# Altium project HA.PrjPcb
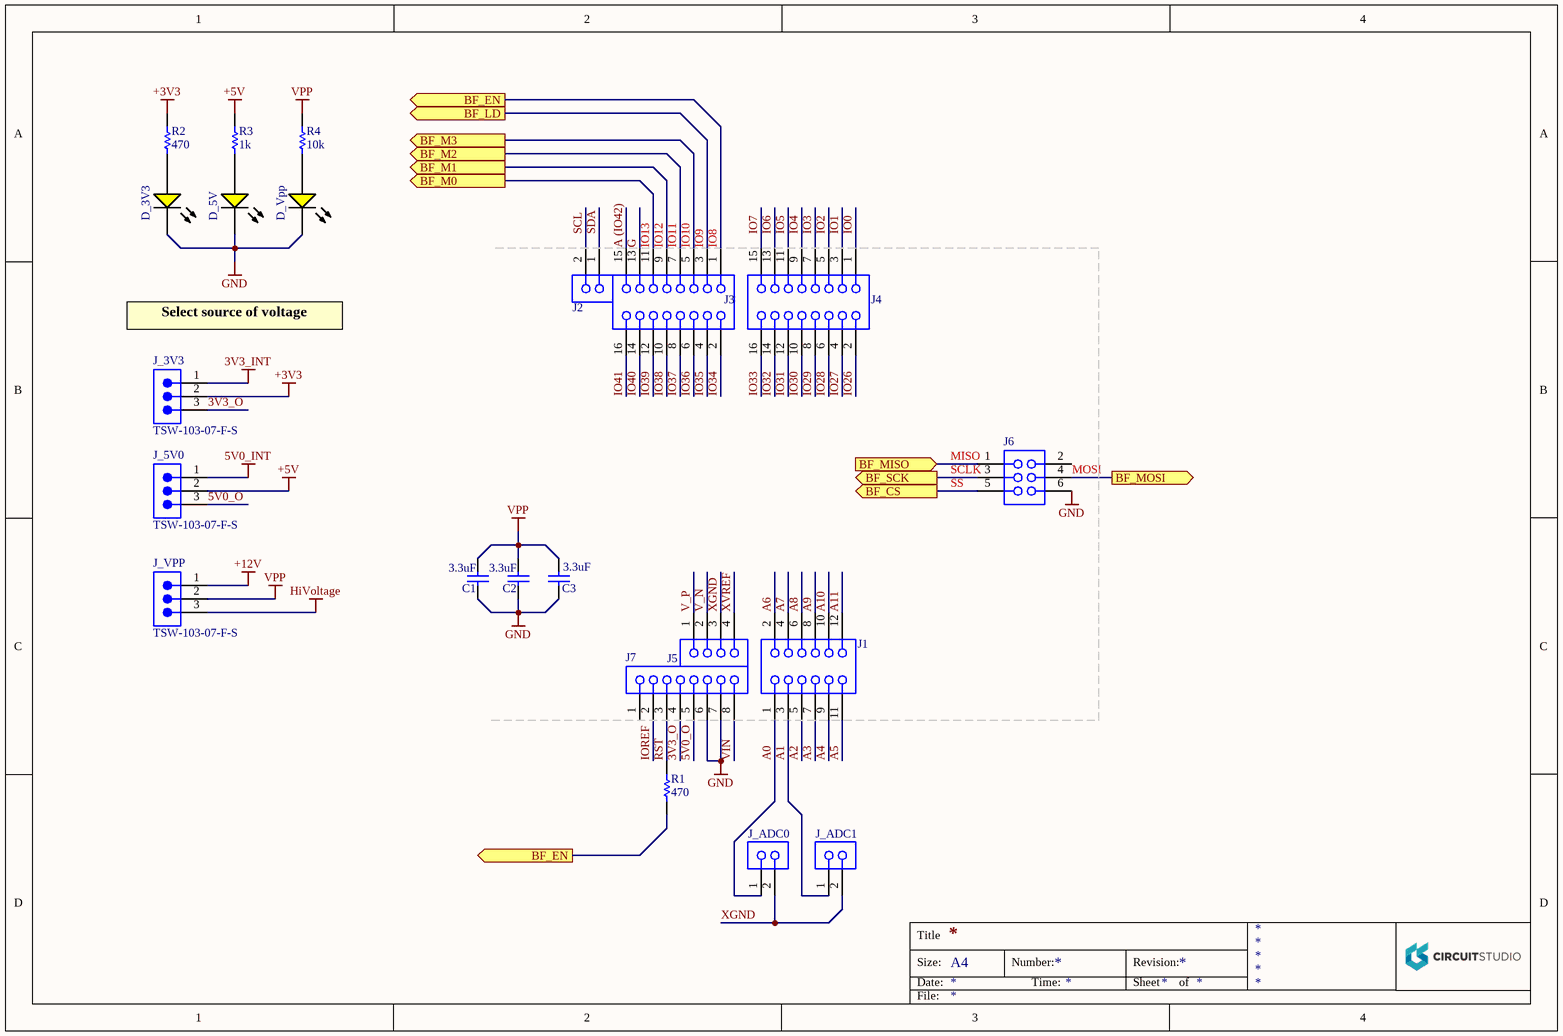
[diagram p0: HA_Diagram.SchDoc]
4 sheets, 87 parts. Net scope: flat (ports and power ports of the same name join across sheets).
Sheets:
  HA_Diagram.SchDoc
  HA_Power.SchDoc
  HA_HiPower.SchDoc
  HA_Out.SchDoc

## Sheet HA_Diagram.SchDoc
size A4; PageSetup: Record=PageOptions|CenterHorizontal=True|CenterVertical=True|PrintScale=1.00|XCorrection=1.00|YCorrection=1.00|PrintKind=0|BorderSize=5000000|LeftOffset=0|BottomOffset=0|Orientation=2|PaperLength=1000|PaperWidth=1000|Scale=100|PaperSource=7|PrintQuality=-3|MediaType=1|DitherType=10|PrintScaleMode=1|PaperKind=A4|PaperIndex=9

### Parts
C1  value 3.3uF  [CAPC1206(3216)190_N]  (hidden comment: 3.3uF 100V)
C2  value 3.3uF  [CAPC1206(3216)190_N]  (hidden comment: 3.3uF 100V)
C3  value 3.3uF  [CAPC1206(3216)190_N]  (hidden comment: 3.3uF 100V)
D_3V3  LED 0603  [LTST-C190KSKT_V]  (value not drawn)
D_5V  LED 0603  [LTST-C190KSKT_V]  (value not drawn)
D_Vpp  LED 0603  [LTST-C190KSKT_V]  (value not drawn)
J1  SSW-106-01-F-D  [SMTC-SSW-106-01-X-D]  (value not drawn)
J2  PHF-102-03-L-S  [SMTC-PHF-102-03-X-S]  (value not drawn)
J3  ESW-108-12-G-D  [SMTC-ESW-108-12-X-D]  (value not drawn)
J4  ESW-108-12-G-D  [SMTC-ESW-108-12-X-D]  (value not drawn)
J5  SLW-104-01-F-S  [SMTC-SLW-104-01-X-S]  (value not drawn)
J6  SSW-103-01-F-D  [SMTC-SSW-103-01-X-D]  (value not drawn)
J7  SSQ-108-01-F-S  [SMTC-SSQ-108-01-X-S]  (value not drawn)
J_3V3  TSW-103-07-F-S  [SMTC-TSW-103-07-X-S]
J_5V0  TSW-103-07-F-S  [SMTC-TSW-103-07-X-S]
J_ADC0  PHF-102-03-L-S  [SMTC-PHF-102-03-X-S]  (value not drawn)
J_ADC1  PHF-102-03-L-S  [SMTC-PHF-102-03-X-S]  (value not drawn)
J_VPP  TSW-103-07-F-S  [SMTC-TSW-103-07-X-S]
R1  470  [RESC0603(1608)_N]
R2  470  [RESC0603(1608)_N]
R3  1k  [RESC0603(1608)_N]
R4  10k  [RESC0603(1608)_N]

### Ports
BF_CS (out), BF_EN (out), BF_LD (out), BF_M0 (out), BF_M1 (out), BF_M2 (out), BF_M3 (out), BF_MISO (in), BF_MOSI (out), BF_SCK (out)

### Nets
3V3_INT: J_3V3.1
5V0_INT: J_5V0.1
+3V3: J_3V3.2 R2.1
+5V: J_5V0.2 R3.1
+12V: J_VPP.1
GND: C1.1 C2.1 C3.1 D_3V3.2(K) D_5V.2(K) D_Vpp.2(K) J6.6 J7.6 J7.7
HiVoltage: J_VPP.3
VPP: C1.2 C2.2 C3.2 J_VPP.2 R4.1
3V3_O: J7.4 J_3V3.3
5V0_O: J7.5 J_5V0.3
A0: J1.1 J_ADC0.1
A1: J1.3 J_ADC1.1
A2: J1.5
A3: J1.7
A4: J1.9
A5: J1.11
A6: J1.2
A7: J1.4
A8: J1.6
A9: J1.8
A10: J1.10
A11: J1.12
A (IO42): J3.15
BF_CS: J6.5 ; port BF_CS
BF_EN: J3.1 R1.2 ; port BF_EN
BF_LD: J3.3 ; port BF_LD
BF_M0: J3.11 ; port BF_M0
BF_M1: J3.9 ; port BF_M1
BF_M2: J3.7 ; port BF_M2
BF_M3: J3.5 ; port BF_M3
BF_MISO: J6.1 ; port BF_MISO
BF_MOSI: J6.4 ; port BF_MOSI
BF_SCK: J6.3 ; port BF_SCK
G: J3.13
IO0: J4.1
IO1: J4.3
IO2: J4.5
IO3: J4.7
IO4: J4.9
IO5: J4.11
IO6: J4.13
IO7: J4.15
IO26: J4.2
IO27: J4.4
IO28: J4.6
IO29: J4.8
IO30: J4.10
IO31: J4.12
IO32: J4.14
IO33: J4.16
IO34: J3.2
IO35: J3.4
IO36: J3.6
IO37: J3.8
IO38: J3.10
IO39: J3.12
IO40: J3.14
IO41: J3.16
IOREF: J7.2
RST: J7.3 R1.1
SCL: J2.2
SDA: J2.1
V_N: J5.2
V_P: J5.1
VIN: J7.8
XGND: J5.3 J_ADC0.2 J_ADC1.2
XVREF: J5.4
NetD_3V3_1: D_3V3.1(A) R2.2
NetD_5V_1: D_5V.1(A) R3.2
NetD_Vpp_1: D_Vpp.1(A) R4.2

Not connected (* = marked no-connect by the designer): J6 2; J7 1

### Notes on the sheet
- (near J3) IO13
- (near J3) IO12
- (near J3) IO11
- (near J3) IO10
- (near J3) IO9
- (near J3) IO8
- Select source of voltage
- (near J6) MISO
- (near J6) SCLK
- (near J6) SS
- (near J6) MOSI
- Title
- Size:
- Date:
- A4
- Number:
- Time:
- Revision:
- Sheet
- of
- File:

### Library data of the parts
C1-C3 = CMP-1037-04411-1: CAP 3.3uF 100V ±20% 1206 (3216 Metric) Thickness 1.9mm SMD; Case-Metric: 3216; Tolerance: Â±20%; Case-EIA: 1206; Max Thickness: 1.9 mm; Rated Voltage: 100 V; Technology: SMT
D_3V3 D_5V D_Vpp = CMP-1674-00009-1: Voltage Rating: 50 V; Case\Package: 0603; Power Rating: 100 mW; Tolerance: 1%; Resistance: 12 kohm; Packaging: Tape and Reel; RoHSCompliant: true; Height: 0.45 mm; Max Operating Temperature: 155 degC; Mount: Surface Mount; DatasheetVersion: Rev. I, 10/2012; Min Operating Temperature: -55 degC; PackageReference: C190KSKT; ComponentLink1Description: Manufacturer URL; Length: 1.6 mm; REACH SVHC: No SVHC; Case Code (Imperial): 0603; Voltage Rating (DC): 50 V; PackageDescription: 2-Pin Surface Mount Device, Body 1.6 x 0.8 mm; Case Code (Metric): 1608; Package Quantity: 5000; ComponentLink2Description: Datasheet; Width: 0.8 mm; Pins: 2; ComponentLink2URL: http://optoelectronics.liteon.com/upload/download/DS-22-99-0189/S_110_LTST-C190KSKT.pdf; ComponentLink1URL: http://www.us.liteon.com/
J1 = CMP-1023-00357-1: SQ Post Socket, Through-hole, Vertical, -55 to 125 degC, 2.54mm Pitch, 12-Pin, Female, RoHS; Manufacturer: Samtec; Temperature Range: -55 to 125 degC; ComponentLink3Description: Package Specification; RoHS: True; PackageDescription: Assembly, Socket Strip .016 X .031 Tail; ComponentLink2URL: http://www.samtec.com/documents/webfiles/pdf/SSW_TH.PDF; ComponentLink1Description: Manufacturer URL; DatasheetVersion: F-214; Orientation: Vertical; PackageReference: SSW-106-01-X-D; Pitch: 2.54 mm; ComponentLink3URL: http://www.samtec.com/documents/webfiles/cpdf/SSW-1XX-XX-XXX-X-XX-XXX-XX-MKT.pdf; PartNumber: SSW-106-01-F-D; Mounting Technology: Through-hole; ComponentLink1URL: http://www.samtec.com; ComponentLink2Description: Datasheet; PackageVersion: CA, 6/1987
J2 J_ADC0 J_ADC1 = CMP-1023-00105-1: Press Fit Socket, Through-hole, Vertical, -55 to 125 degC, 2.54 mm Pitch, 2-Pin, Female, RoHS; Manufacturer: Samtec; Pitch: 2.54 mm; Orientation: Vertical; RoHS: True; DatasheetVersion: F-214; PackageReference: PHF-102-03-X-S; Temperature Range: -55 to 125 degC; ComponentLink1Description: Manufacturer URL; ComponentLink3Description: Package Specification; PackageVersion: F, 9/2009; ComponentLink2Description: Datasheet; ComponentLink3URL: http://www.samtec.com/documents/webfiles/cpdf/PHF-1XX-XX-X-X-XXX-MKT.pdf; PartNumber: PHF-102-03-L-S; ComponentLink1URL: http://www.samtec.com; ComponentLink2URL: http://www.samtec.com/documents/webfiles/pdf/phf.pdf; Mounting Technology: Through-hole; PackageDescription: .100 Press Fit Socket Assembly
J3 J4 = CMP-1023-00046-1: Elevated Socket, Through-hole, Vertical, -55 to 125 degC, 2.54 mm Pitch, 16-Pin, Female, RoHS; Manufacturer: Samtec; Pitch: 2.54 mm; PackageVersion: AV, 7/1985; PackageReference: ESW-108-12-X-D; ComponentLink2Description: Datasheet; ComponentLink1Description: Manufacturer URL; DatasheetVersion: F-214; Temperature Range: -55 to 125 degC; Mounting Technology: Through-hole; PartNumber: ESW-108-12-G-D; RoHS: True; PackageDescription: ESW Strip ASM; ComponentLink3Description: Package Specification; ComponentLink2URL: http://www.samtec.com/documents/webfiles/pdf/ESW_TH.PDF; ComponentLink3URL: http://www.samtec.com/documents/webfiles/cpdf/ESW-1XX-XX-X-X-XX-XX-MKT.pdf; Orientation: Vertical; ComponentLink1URL: http://www.samtec.com
J5 = CMP-1023-00132-1: Low Profile Socket Strips, Through-hole, Vertical, -55 to 125 degC, 2.54 mm Pitch, 4-Pin, Female, RoHS; Manufacturer: Samtec; Pitch: 2.54 mm; PackageVersion: X, 9/1987; ComponentLink2Description: Datasheet; PackageDescription: Low Profile Socket Strip; ComponentLink1URL: http://www.samtec.com; Orientation: Vertical; ComponentLink3URL: http://www.samtec.com/documents/webfiles/cpdf/SLW-1XX-01-X-X-MKT.pdf; ComponentLink1Description: Manufacturer URL; ComponentLink2URL: http://www.samtec.com/documents/webfiles/pdf/SLW.PDF; PackageReference: SLW-104-01-X-S; Mounting Technology: Through-hole; PartNumber: SLW-104-01-F-S; Temperature Range: -55 to 125 degC; DatasheetVersion: F-214; ComponentLink3Description: Package Specification; RoHS: True
J6 = CMP-1023-00329-1: SQ Post Socket, Through-hole, Vertical, -55 to 125 degC, 2.54 mm Pitch, 6-Pin, Female, RoHS; Manufacturer: Samtec; Pitch: 2.54 mm; Temperature Range: -55 to 125 degC; ComponentLink3URL: http://www.samtec.com/documents/webfiles/cpdf/SSW-1XX-XX-XXX-X-XX-XXX-XX-MKT.pdf; ComponentLink1URL: http://www.samtec.com; Orientation: Vertical; PackageReference: SSW-103-01-X-D; RoHS: True; ComponentLink1Description: Manufacturer URL; PartNumber: SSW-103-01-F-D; PackageVersion: CA, 6/1987; ComponentLink2URL: http://www.samtec.com/documents/webfiles/pdf/SSW_TH.PDF; ComponentLink3Description: Package Specification; Mounting Technology: Through-hole; PackageDescription: Assembly, Socket Strip .016 X .031 Tail; DatasheetVersion: F-214; ComponentLink2Description: Datasheet
J7 = CMP-1023-00294-1: SQ Post Socket, Through-hole, Vertical, -55 to 125 degC, 2.54 mm Pitch, 8-Pin, Female, RoHS; Manufacturer: Samtec; Pitch: 2.54 mm; ComponentLink3URL: http://www.samtec.com/documents/webfiles/cpdf/SSQ-1XX-XX-XXX-X-XX-XXX-XX-X-MKT.pdf; ComponentLink2URL: http://www.samtec.com/documents/webfiles/pdf/SSQ_TH.PDF; Mounting Technology: Through-hole; PackageReference: SSQ-108-01-X-S; Orientation: Vertical; PackageDescription: Assembly, Socket Strip .025[0.64] SQ Tail; ComponentLink2Description: Datasheet; PartNumber: SSQ-108-01-F-S; Temperature Range: -55 to 125 degC; ComponentLink1URL: http://www.samtec.com; ComponentLink3Description: Package Specification; PackageVersion: BD, 6/1987; RoHS: True; ComponentLink1Description: Manufacturer URL; DatasheetVersion: F-214
J_3V3 J_5V0 J_VPP = CMP-1024-00331-1: 0.025" SQ Post Header, Through-hole, Vertical, -55 to 125 degC, 2.54 mm Pitch, 3-Pin, Male, RoHS; Manufacturer: Samtec; Pitch: 2.54 mm; DatasheetVersion: F-214; ComponentLink1Description: Manufacturer URL; ComponentLink3URL: http://www.samtec.com/documents/webfiles/cpdf/TSW-XXX-XX-XXX-X-XX-XXX-MKT.pdf; Mounting Technology: Through-hole; PackageDescription: .025[0.64] SQ. Post Terminal Strip Assembly; Temperature Range: -55 to 125 degC; ComponentLink3Description: Package Specification; Orientation: Vertical; PartNumber: TSW-103-07-F-S; RoHS: True; PackageVersion: DM, 8/1988; ComponentLink2Description: Datasheet; ComponentLink1URL: http://www.samtec.com; ComponentLink2URL: http://www.samtec.com/documents/webfiles/pdf/TSW_TH.PDF; PackageReference: TSW-103-07-X-S
R1-R4 = CMP-1012-00122-1: 200 1% 0603 SMD; Value: 200 Ohm; Tolerance: 1 %

## Sheet HA_Power.SchDoc: transc
size A4; Date: 11/21/2016 9:12:52 PM; SheetNumber: 2; PageSetup: Record=PageOptions|CenterHorizontal=True|CenterVertical=True|PrintScale=0.98|XCorrection=1.00|YCorrection=1.00|PrintKind=0|BorderSize=5000000|LeftOffset=0|BottomOffset=0|Orientation=2|PaperLength=1000|PaperWidth=1000|Scale=100|PaperSource=7|PrintQuality=-3|MediaType=1|DitherType=10|PrintScaleMode=1|PaperKind=A4|PaperIndex=9
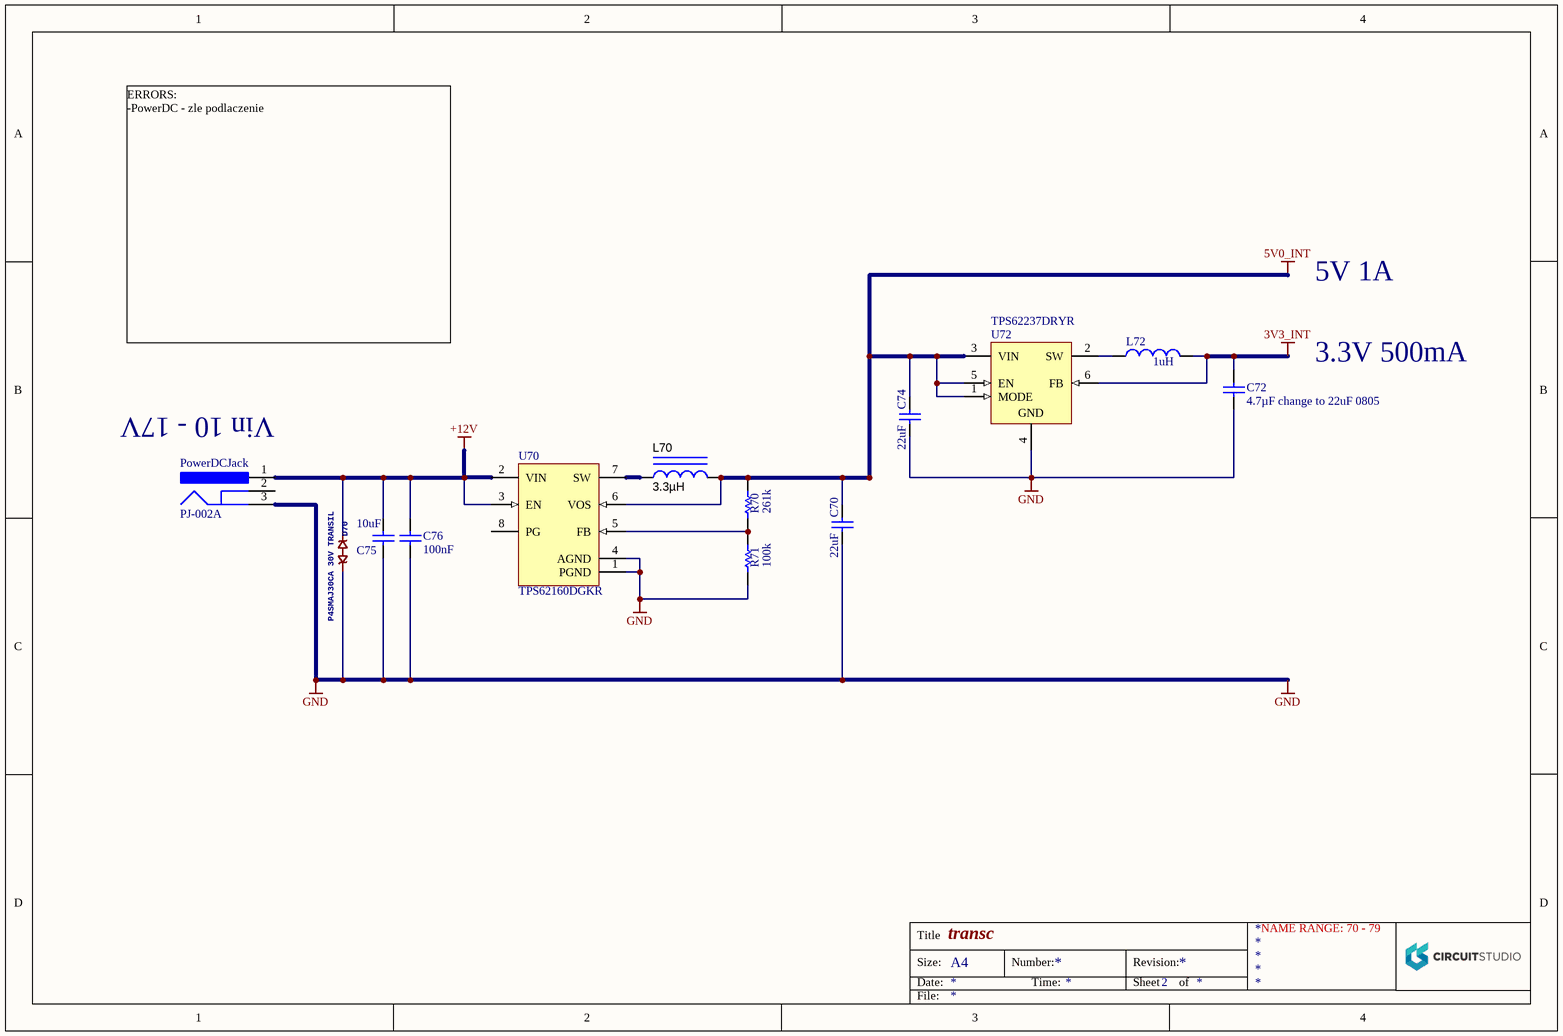
[diagram p1: HA_Power.SchDoc]

### Parts
C70  value 22uF  [CAPC0805(2012)75_N]  (hidden comment: 22uF 10V)
C72  Capacitance: 4.7µF change to 22uF 0805  [CAPC1608X95X30NL15T20]  (hidden comment: 4.7uF CL10B475KQ8NQNC)
C74  value 22uF  [CAPC0805(2012)75_N]  (hidden comment: 22uF 10V)
C75  value 10uF  [CAPC1206(3216)190_N]  (hidden comment: 10uF 35V)
C76  value 100nF  [CAPC0603(1608)100_L]  (hidden comment: 100nF 100V)
D70  P4SMAJ30CA 30V TRANSIL  [DO214AC_BIDIR]
L70  ValueDisplayed: 3.3µH  [XPL2010]  (hidden comment: 3.3uH XPL2010-332MLB)
L72  Inductance: 1uH  [MURA-IND0805_H_0.55_M]  (hidden comment: LQM21PN2R2MC0D)
PowerDCJack  PJ-002A  [CUI-PJ-002A_V]
R70  261k  [RESC0603(1608)_N]
R71  100k  [RESC0603(1608)_N]
U70  TPS62160DGKR  [DGK8_N]
U72  TPS62237DRYR  [DRY0006A]

### Nets
3V3_INT: C72.2 L72.2 U72.6(FB)
5V0_INT: C70.2 C74.2 L70.2 R70.2 U70.6(VOS) U72.1(MODE) U72.3(VIN) U72.5(EN)
+12V: C75.2 C76.1 D70.2 PowerDCJack.1 U70.2(VIN) U70.3(EN)
GND: C70.1 C72.1 C74.1 C75.1 C76.2 D70.1 PowerDCJack.3 R71.1 U70.1(PGND) U70.4(AGND) U72.4(GND)
NetL70_1: L70.1 U70.7(SW)
NetL72_1: L72.1 U72.2(SW)
NetR70_1: R70.1 R71.2 U70.5(FB)

Not connected (* = marked no-connect by the designer): PowerDCJack 2; U70 8(PG)

### Notes on the sheet
- 5V 1A
- ERRORS:
  -PowerDC - zle podlaczenie
- 3.3V 500mA
- (near PowerDCJack) Vin 10 - 17V
- NAME RANGE: 70 - 79
- Title
- Size:
- Date:
- A4
- Number:
- Time:
- Revision:
- Sheet
- of
- File:

### Library data of the parts
C70 C74 = CMP-1036-00417-1: Case-EIA: 0805; Tolerance: ±10%; Case-Metric: 2012; Technology: SMT; Max Thickness: 0.75 mm; Rated Voltage: 10 V
C72 = CMP-2000-06096-1: Manufacturer: Samsung Electro-Mechanics; Temperature Coefficient: X7R; Other Names: 1276-2087-2; Featured Product: Multi-LayerCeramicCapacitors; Voltage - Rated: 6.3V; Tolerance: ±10%; Product Training Modules: AutoGradeMLCCHighCapMLCCFamilySoftTerminationMLCC; Online Catalog: CLSeries,HighCapacitance; RoHS Information: MLCCRoHS2Compliance; Package / Case: 0603(1608Metric); Datasheet URL: http://media.digikey.com/pdf/Data%20Sheets/Samsung%20PDFs/CL10B475KQ8NQNC_Spec.pdf; Family: CeramicCapacitors; Category: Capacitors; Packaging: Tape&Reel(TR); Operating Temperature: -55°C~125°C; Datasheet Version: 09/2013; Lead Spacing: -; Mounting Type: SurfaceMount,MLCC; Ratings: -; Applications: GeneralPurpose; Height - Seated (Max): -; Series: CL; Package Reference: 0603; Manufacturer URL: http://www.samsungsem.com/global/index.jsp; Thickness (Max): 0.035"(0.90mm); Lead Style: -; Package Description: 2-Pin Surface Mount Device, Body 1.6 x 0.8 mm; Size / Dimension: 0.063"Lx0.031"W(1.60mmx0.80mm); Features: -; Mounting Technology: SurfaceMount; Standard Package: 4,000
C75 = CMP-1037-04990-1: CAP 1206 (3216 Metric) Thickness 1.9mm SMD; Rated Voltage: 10 V; Tolerance: Â±20%; Case-EIA: 1206; Case-Metric: 3216; Max Thickness: 1.9 mm; Technology: SMT
C76 = CMP-1035-00529-1: CAP 100nF 100V ±10% 0603 (1608 Metric) Thickness 1mm SMD; Case-Metric: 1608; Case-EIA: 0603; Rated Voltage: 100 V; Max Thickness: 1 mm; Technology: SMT; Tolerance: ±10%
D70 = DIODE_BIDIR-DO214AC
L70 = XPL2010-332MLB: XPL2010 Inductor; Manufacturer: Coilcraft; Ind_H: 3.3E-6; Imax_A: 1.05; Irms: 1.1A @ 40C rise; Isat: 1.05A @ 30% inductance drop; DCR_ohm: 0.21; Value1: 0.21 ohm; Value2: 1.05A; Material: Composite; SizeAreaWB_mm2: 8.7; SizeArea_mm2: 3.8; SizeX_mm: 2; SizeY_mm: 1.9; SizeZ_mm: 1; AEC Category: Q200; SymbolVersion: 2008-07-23; CompType: Inductor; Value: 3.3uH; PartNumber: XPL2010-332MLB; Technology: Shielded; MountType: SMT; PackageReference: XPL2010; Published: 2008-06-26; Publisher: Texas Instruments; LatestRevisionDate: 2016-12-22; ComponentLink1Description: Datasheet link; ComponentLink1URL: http://www.coilcraft.com/pdfs/xpl2010.pdf; RoHS: Y; AEC Qualified: ?
L72 = CMP-2000-06589-1: Chip Inductor, 1.0 uH, +/- 20%, -55 to 125 degC, 2-Pin SMD (0805), RoHS, Tape and Reel; Manufacturer: Murata; Rated Current-Max: 800mA; DC Resistance: 0.19; Mounting Technology: SurfaceMount; Package Reference: 0805; Tolerance (%): 20%; Datasheet Version: 07/2014; Manufacturer URL: http://www.murata.com/; Package Description: 2-Pin Surface Mounted Device, Body 2 x 1.25 mm; Case Size/Dimension: 0805; Datasheet URL: https://datasheet.ciiva.com/3866/336lqm21pn1r0mc023-3866307.pdf
PowerDCJack = CMP-2000-06895-1: Through Hole Right Angle DC Power Jack, 2.5 A, 2 mm Center Pin, 3 Position, -25 to 85 degC, RoHS, Bulk; Manufacturer: CUIInc.; Current Rating: 2.5A; Inside Contact Diameter: 2mm; Insulation Resistance: 50MOhms; Outside Contact Diameter: 6.5mm; Voltage Rating: 24V; Brand: CUI; Operating Temperature Range: -25Cto+85C; Mounting Technology: ThroughHole; Connector Type: DCPowerJack; Contact Material: Copper; Datasheet URL: http://www.cui.com/product/resource/pj-002a.pdf; Contact Gender: Male; Housing Material: PolybutyleneTerephthalate(PBT); Manufacturer URL: http://www.cui.com/; Package Reference: PJ-002A; Mounting Style: ThroughHole; Mounting Angle: Right; Product Category: DCPowerConnectors; Product: Jacks; Flammability Rating: UL94V-0; Contact Plating: Nickel; RoHS: True; Datasheet Version: Rev. 1.03, 04/2016; Package Description: 3-Pin Through Hole Device, Body 14.4 x 9 mm, Height 11 mm; Factory Pack Quantity: 500; Termination Style: ThroughHole
R70 R71 = CMP-1012-00122-1: 1% 0603 SMD; Value: 22k Ohm; Tolerance: 1 %
U70 = CMP-0323-00440-1: Buck Step Down Regulator with 3 to 17 V Input and 0.9 to 6 V Output, -40 to 85 degC, 8-Pin VSOP (DGK), Green (RoHS & no Sb/Br); Manufacturer: Texas Instruments; Regulated Outputs(#): 1; Vout(Min)(V): 0.9; Switch Current Limit(Typ)(A): 1.8; SubFamily: Step-Down Regulator; Vout(Max)(V): 6; Vin(Max)(V): 17; Iq(Typ)(mA): 0.017; Duty Cycle(Max)(%): 100; Synchronous Rectification: TRUE; Rating: Catalog; Vin(Min)(V): 3; PackageDescription: 8-Pin Thin Small Outline Package 3 x 3 mm Body ,0.65 mm Pitch; PackageVersion: revE, May-2006; PackageReference: DGK8; ComponentLink1URL: http://www.ti.com/general/docs/lit/getliterature.tsp?genericPartNumber=TPS62160&fileType=pdf; ComponentLink2Description: URL Link1; Iout(Max)(A): 1; ComponentLink1Description: Datasheet; Eco-Plan: Green (RoHS & no Sb/Br); Code_JEDEC: MO-187-AA; Topology: Buck; PartNumber: TPS62160DGKR; ComponentLink2URL: Samples URL:http://www.ti.com/product/tps62160#samples; DatasheetVersion: SLVSAM2A; Mounting Technology: Surface Mount
U72 = CMP-0323-00243-3: Buck Step Down Regulator with 2.05 to 6 V Input and 3.3 V Output, -40 to 85 degC, 6-Pin SON (DRY), Green (RoHS & no Sb/Br); Manufacturer: Texas Instruments; Vout(Max)(V): 3.3; Switch Current Limit(Typ)(A): 0.84; Iq(Typ)(mA): 0.022; Iout(Max)(A): 0.5; Synchronous Rectification: TRUE; Regulated Outputs(#): 1; Vin(Min)(V): 2.05; SubFamily: Step-Down Regulator; Rating: Catalog; Duty Cycle(Max)(%): 100; Vin(Max)(V): 6; PackageReference: DRY0006A; PartNumber: TPS62237DRYR; Mounting Technology: Surface Mount; Preset Vout(V): 3.3; Topology: Buck; DatasheetVersion: SLVS941E; ComponentLink2Description: Package Specification; PackageVersion: revF, Dec-2011; PackageDescription: 6-Pin Plastic Small Outline No-Lead, 1 x 1.45 x 0.6 mm Body, 0.5 mm Pitch; ComponentLink3Description: URL Link1; ComponentLink1Description: Datasheet; Eco-Plan: Green (RoHS & no Sb/Br); ComponentLink2URL: http://www.ti.com/litv/pdf/mpds221e; ComponentLink1URL: http://www.ti.com/general/docs/lit/getliterature.tsp?genericPartNumber=TPS62237&fileType=pdf; Vout(Min)(V): 3.3; ComponentLink3URL: Samples URL:http://www.ti.com/product/tps62237#samples

## Sheet HA_HiPower.SchDoc: transc
size A4; Date: 11/21/2016 9:12:53 PM; SheetNumber: 3; PageSetup: Record=PageOptions|CenterHorizontal=True|CenterVertical=True|PrintScale=1.02|XCorrection=1.00|YCorrection=1.00|PrintKind=0|BorderSize=5000000|LeftOffset=0|BottomOffset=0|Orientation=2|PaperLength=1000|PaperWidth=1000|Scale=100|PaperSource=7|PrintQuality=-3|MediaType=1|DitherType=10|PrintScaleMode=1|PaperKind=A4 (Borderless)|PaperIndex=274
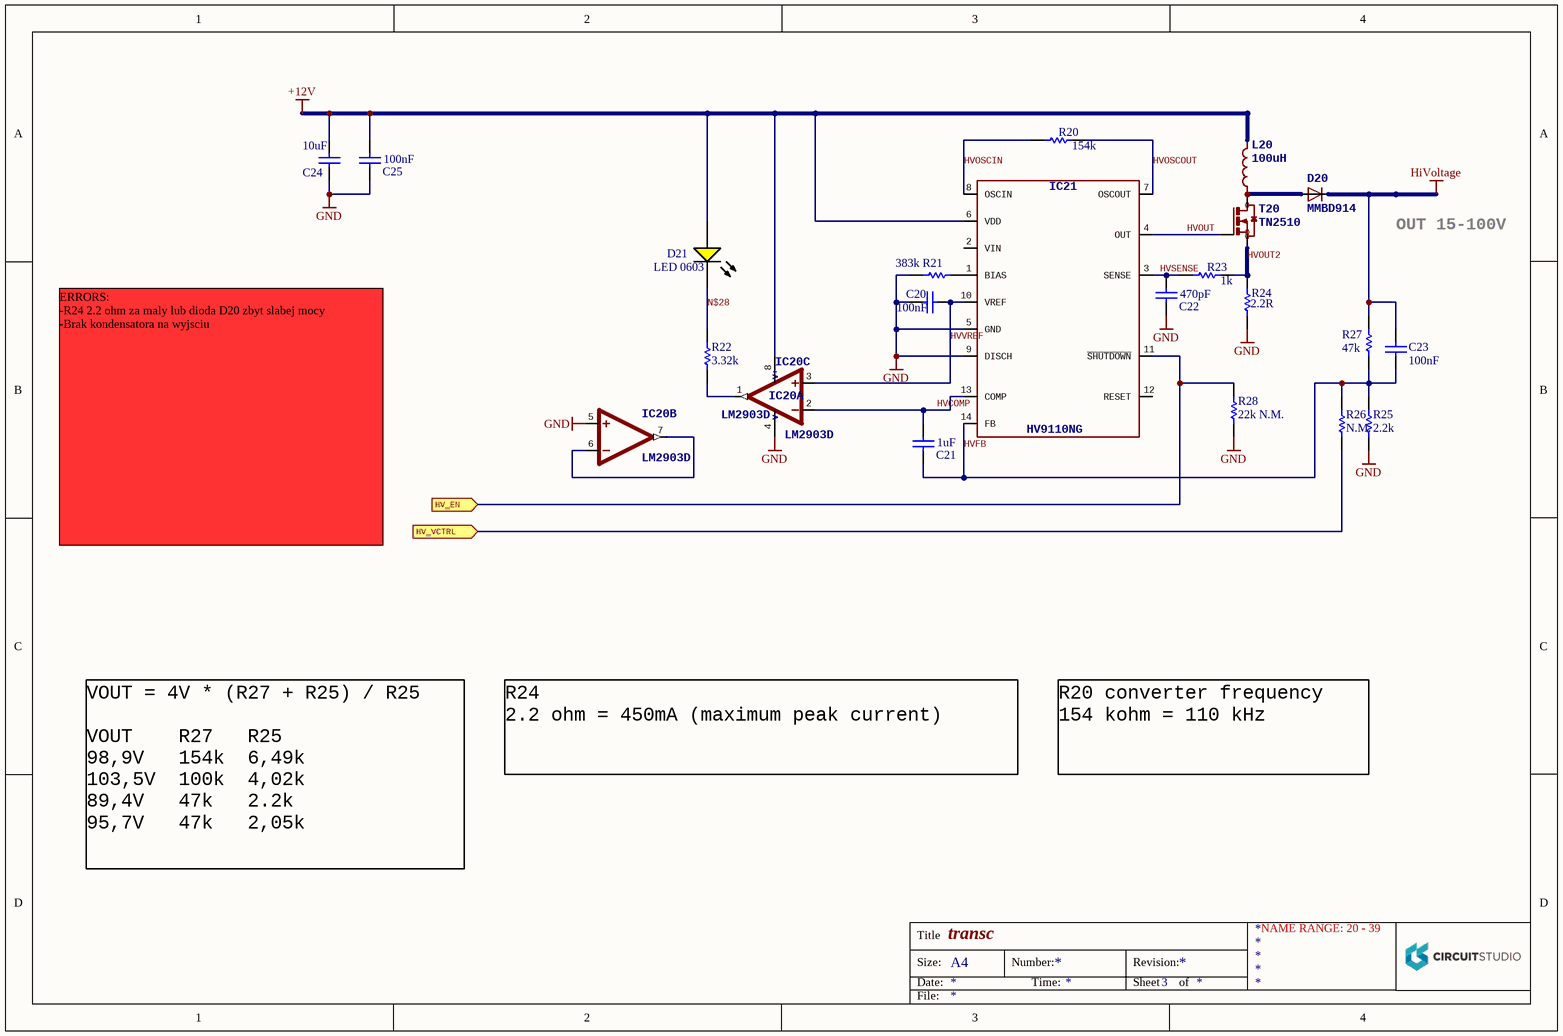
[diagram p2: HA_HiPower.SchDoc]

### Parts
C20  value 100nF  [CAPC0805(2012)145_L]  (hidden comment: 100nF 100V)
C21  value 1uF  [CAPC0805(2012)145_L]  (hidden comment: 1uF 100V)
C22  value 470pF  [CAPC0805(2012)145_L]  (hidden comment: 470pF 100V)
C23  value 100nF  [CAPC0805(2012)145_L]  (hidden comment: 100nF 100V)
C24  value 10uF  [CAPC1206(3216)190_N]  (hidden comment: 10uF 35V)
C25  value 100nF  [CAPC0805(2012)145_L]  (hidden comment: 100nF 100V)
D20  MMBD914  [SOT23]
D21  LED 0603  [LTST-C190KSKT_V]
IC20  LM2903D  [SO08]  (parts A,B,C of 3)
IC21  HV9110NG  [SOIC14]
L20  100uH  [LPS8045B]
R20  154k  [RESC0603(1608)_N]
R21  383k  [RESC0603(1608)_N]
R22  3.32k  [RESC0603(1608)_N]
R23  1k  [RESC0603(1608)_N]
R24  value 2.2R  [RESC2512(6432)_M]  (hidden comment: 2.2R 5%)
R25  2.2k  [RESC0603(1608)_N]
R26  N.M.  [RESC0603(1608)_N]
R27  47k  [RESC0603(1608)_N]
R28  22k N.M.  [RESC0603(1608)_N]
T20  TN2510  [SOT89]

### Ports
HV_EN (in), HV_VCTRL (in)

### Nets
+12V: C24.2 C25.2 D21.1(A) IC20.8(V+) IC21.6(VDD) L20.2
GND: C20.2 C22.1 C24.1 C25.1 IC20.4(V-) IC20.5(+IN) IC21.5(GND) IC21.9(DISCH) R21.1 R24.1 R25.1 R28.1
HiVoltage: C23.1 D20.C R27.2
HV_EN: IC21.11(~{SHUTDOWN}) R28.2 ; port HV_EN
HV_VCTRL: R26.1 ; port HV_VCTRL
HVCOMP: C21.2 IC20.2(-IN) IC21.13(COMP)  [project net HVCOMP_3]
HVFB: C21.1 C23.2 IC21.14(FB) R25.2 R26.2 R27.1  [project net HVFB_3]
HVOSCIN: IC21.8(OSCIN) R20.1  [project net HVOSCIN_3]
HVOSCOUT: IC21.7(OSCOUT) R20.2  [project net HVOSCOUT_3]
HVOUT: IC21.4(OUT) T20.1(G)  [project net HVOUT_3]
HVOUT2: R23.2 R24.2 T20.3(S)  [project net HVOUT2_3]
HVSENSE: C22.2 IC21.3(SENSE) R23.1  [project net HVSENSE_3]
HVVREF: C20.1 IC20.3(+IN) IC21.10(VREF)  [project net HVVREF_3]
N$28: D21.2(K) R22.1  [project net N$28_3]
NetD20_B: D20.B(A) L20.1 T20.2(D)
NetIC20_1: IC20.1(OUT) R22.2
NetIC20_6: IC20.6(-IN) IC20.7(OUT)
NetIC21_1: IC21.1(BIAS) R21.2

Not connected (* = marked no-connect by the designer): IC21 2(VIN) 12(RESET)

### Notes on the sheet
- OUT 15-100V
- ERRORS:
  -R24 2.2 ohm za maly lub dioda D20 zbyt slabej mocy
  -Brak kondensatora na wyjsciu
- R24
  2.2 ohm = 450mA (maximum peak current)
- R20 converter frequency
  154 kohm = 110 kHz
- VOUT = 4V * (R27 + R25) / R25
  VOUT    R27   R25
  98,9V   154k  6,49k
  103,5V  100k  4,02k
  89,4V   47k   2.2k
  95,7V   47k   2,05k
- NAME RANGE: 20 - 39
- Title
- Size:
- Date:
- A4
- Number:
- Time:
- Revision:
- Sheet
- of
- File:

### Library data of the parts
C20-C23 C25 = CMP-1036-04431-1: Case-Metric: 2012; Tolerance: Â±20%; Case-EIA: 0805; Technology: SMT; Rated Voltage: 100 V; Max Thickness: 1.45 mm
C24 = CMP-1037-04990-1: as C75 on sheet HA_Power; Max Thickness: 1.9 mm; Technology: SMT
D20 = DIODE-SOT23
D21 = CMP-1674-00009-1: as D_3V3 on sheet HA_Diagram; Packaging: Tape and Reel; RoHSCompliant: true; Height: 0.45 mm; Max Operating Temperature: 155 degC; Mount: Surface Mount; DatasheetVersion: Rev. I, 10/2012; Min Operating Temperature: -55 degC; PackageReference: C190KSKT; ComponentLink1Description: Manufacturer URL; Length: 1.6 mm; REACH SVHC: No SVHC; Case Code (Imperial): 0603; Voltage Rating (DC): 50 V; PackageDescription: 2-Pin Surface Mount Device, Body 1.6 x 0.8 mm; Case Code (Metric): 1608; Package Quantity: 5000; ComponentLink2Description: Datasheet; Width: 0.8 mm; Pins: 2; ComponentLink2URL: http://optoelectronics.liteon.com/upload/download/DS-22-99-0189/S_110_LTST-C190KSKT.pdf; ComponentLink1URL: http://www.us.liteon.com/
IC20 = LM2903D: COMPARATOR
L20 = LDE1205: MPN: LPS8045B-104; Inductance: 100uH
R20 R27 R28 = CMP-1012-00122-1: 1% 0603 SMD; Value: 154k Ohm; Tolerance: 1 %
R21 = CMP-1012-00122-1: 1% 0603 SMD; Value: 383k Ohm; Tolerance: 1 %
R22 = CMP-1012-00122-1: 1% 0603 SMD; Value: 3.32k Ohm; Tolerance: 1 %
R23 = CMP-1012-00122-1: 1% 0603 SMD; Value: 1k Ohm; Tolerance: 1 %
R24 = CMP-1018-00050-1: 2.2R 1W 5% 2512 SMD; Case-EIA: 2512; Case-Metric: 6432; Tolerance: 5 %; Power: 1 W; Technology: SMT
R25 = CMP-1012-00122-1: 1% 0603 SMD; Value: 6.49k Ohm; Tolerance: 1 %
R26 = CMP-1012-00122-1: 1% 0603 SMD; Value: k Ohm; Tolerance: 1 %
T20 = MOSFET_NSOT89

## Sheet HA_Out.SchDoc: transc
size A4; Date: 11/21/2016 9:12:50 PM; Author: TO; Revision: VA; SheetNumber: 1; PageSetup: Record=PageOptions|CenterHorizontal=True|CenterVertical=True|PrintScale=0.85|XCorrection=1.00|YCorrection=1.00|PrintKind=0|BorderSize=5000000|LeftOffset=0|BottomOffset=0|Orientation=2|PaperLength=1000|PaperWidth=1000|Scale=100|PaperSource=7|PrintQuality=-4|MediaType=1|DitherType=10|PrintScaleMode=1|PaperKind=A4 (Borderless)|PaperIndex=274
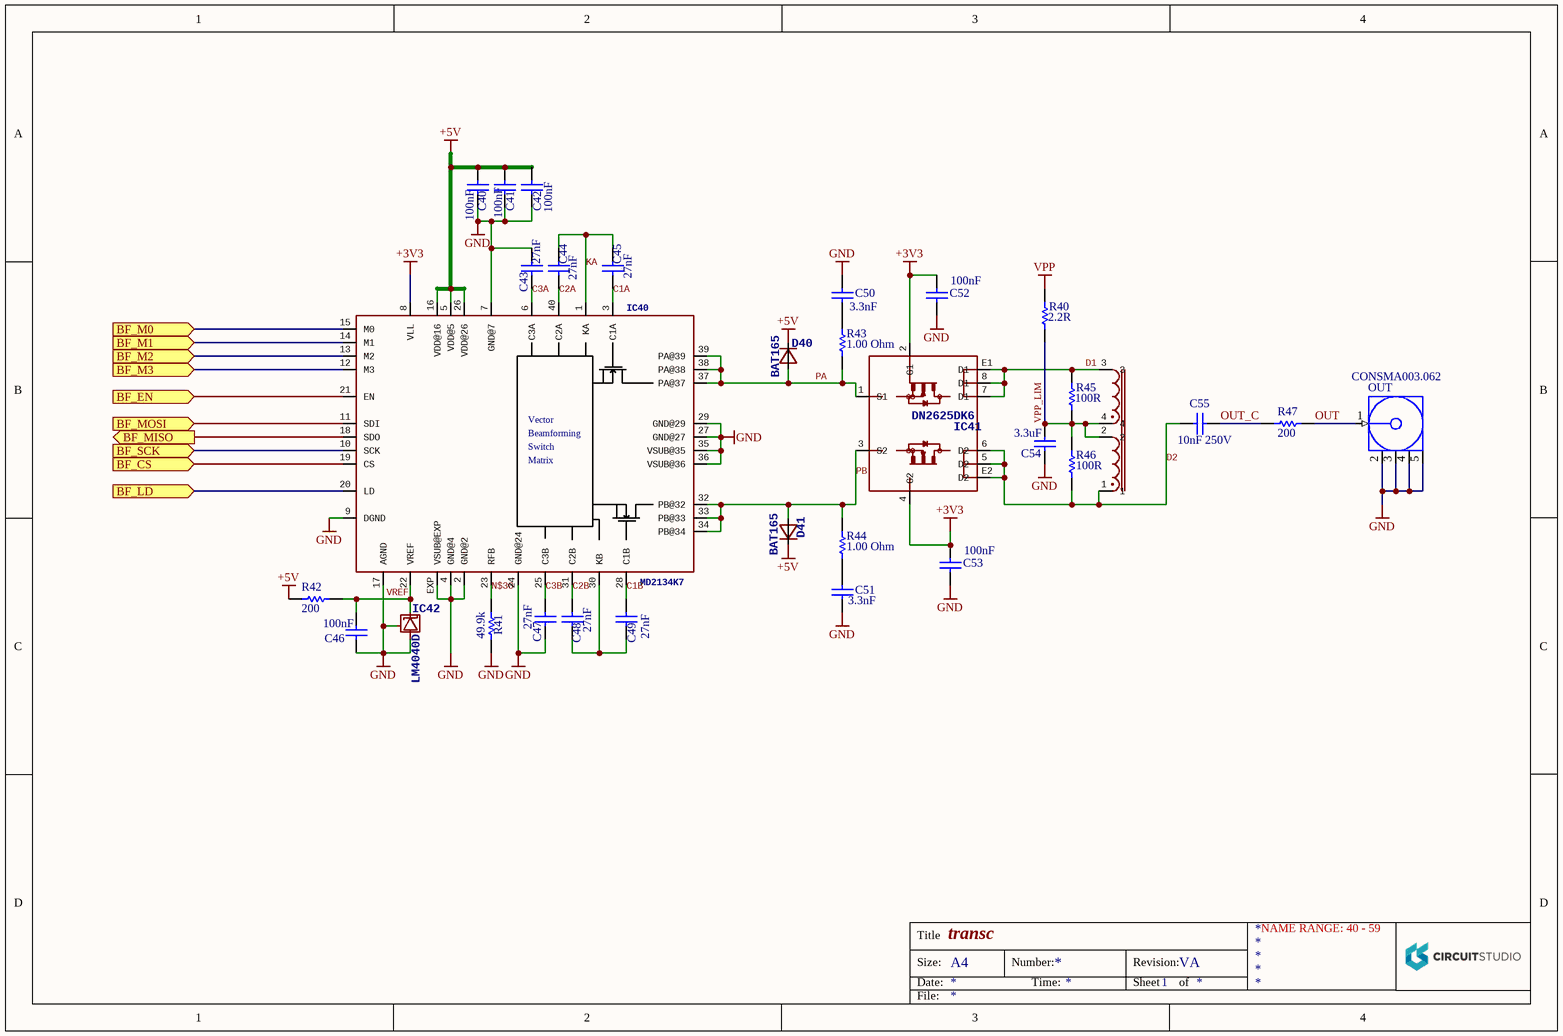
[diagram p3: HA_Out.SchDoc]

### Parts
C40  value 100nF  [CAPC0603(1608)100_L]  (hidden comment: 100nF 100V)
C41  value 100nF  [CAPC0603(1608)100_L]  (hidden comment: 100nF 100V)
C42  value 100nF  [CAPC0603(1608)100_L]  (hidden comment: 100nF 100V)
C43  value 27nF  [CAPC0603(1608)100_L]  (hidden comment: 27nF 100V)
C44  value 27nF  [CAPC0603(1608)100_L]  (hidden comment: 27nF 100V)
C45  value 27nF  [CAPC0603(1608)100_L]  (hidden comment: 27nF 100V)
C46  value 100nF  [CAPC0603(1608)100_L]  (hidden comment: 100nF 100V)
C47  value 27nF  [CAPC0603(1608)100_L]  (hidden comment: 27nF 100V)
C48  value 27nF  [CAPC0603(1608)100_L]  (hidden comment: 27nF 100V)
C49  value 27nF  [CAPC0603(1608)100_L]  (hidden comment: 27nF 100V)
C50  value 3.3nF  [CAPC0805(2012)75_N]  (hidden comment: 3.3nF 100V)
C51  value 3.3nF  [CAPC0805(2012)75_N]  (hidden comment: 3.3nF 100V)
C52  value 100nF  [CAPC0603(1608)100_L]  (hidden comment: 100nF 100V)
C53  value 100nF  [CAPC0603(1608)100_L]  (hidden comment: 100nF 100V)
C54  value 3.3uF  [CAPC1206(3216)190_N]  (hidden comment: 3.3uF 100V)
C55  10nF 250V  [CAPC0805(2012)75_N]
D40  BAT165  [SOD323]
D41  BAT165  [SOD323]
IC40  MD2134K7  [QFN40-5X5]
IC41  DN2625DK6  [DFN8K6]
IC42  LM4040D  [DBZ_R-PDSO-G3]
L40  LPD6235-682MEB  [LPD5235MR]  (value not drawn)
OUT  CONSMA003.062  [CON-SMA-EDGE062]
R40  value 2.2R  [RESC2512(6432)_M]  (hidden comment: 2.2R 5%)
R41  49.9k  [RESC0603(1608)_N]
R42  200  [RESC0603(1608)_N]
R43  value 1.00 Ohm  [RESC2512(6432)_M]  (hidden comment: 1R 5%)
R44  value 1.00 Ohm  [RESC2512(6432)_M]  (hidden comment: 1R 5%)
R45  value 100R  [RESC2512(6432)_M]  (hidden comment: 100R 5%)
R46  value 100R  [RESC2512(6432)_M]  (hidden comment: 100R 5%)
R47  value 200  [RESC0805(2012)_L]  (hidden comment: 200R 1% 0805(2012))

### Ports
BF_CS (in), BF_EN (in), BF_LD (in), BF_M0 (in), BF_M1 (in), BF_M2 (in), BF_M3 (in), BF_MISO (out), BF_MOSI (in), BF_SCK (in)

### Nets
+3V3: C52.2 C53.2 IC40.8(VLL) IC41.2(G1) IC41.4(G2)
+5V: C40.2 C41.2 C42.2 D40.C D41.C IC40.5(VDD@5) IC40.16(VDD@16) IC40.26(VDD@26) R42.2
GND: C40.1 C41.1 C42.1 C43.2 C46.1 C47.1 C50.2 C51.1 C52.1 C53.1 C54.1 IC40.2(GND@2) IC40.4(GND@4) IC40.7(GND@7) IC40.9(DGND) IC40.17(AGND) IC40.24(GND@24) IC40.27(GND@27) IC40.29(GND@29) IC40.35(VSUB@35) IC40.36(VSUB@36) IC40.EXP(VSUB@EXP) IC42.2(A) IC42.3(FB) OUT.2(GND) OUT.3(GND) OUT.4(GND) OUT.5(GND) R41.1
VPP: R40.2
BF_CS: IC40.19(CS) ; port BF_CS
BF_EN: IC40.21(EN) ; port BF_EN
BF_LD: IC40.20(LD) ; port BF_LD
BF_M0: IC40.15(M0) ; port BF_M0
BF_M1: IC40.14(M1) ; port BF_M1
BF_M2: IC40.13(M2) ; port BF_M2
BF_M3: IC40.12(M3) ; port BF_M3
BF_MISO: IC40.18(SDO) ; port BF_MISO
BF_MOSI: IC40.11(SDI) ; port BF_MOSI
BF_SCK: IC40.10(SCK) ; port BF_SCK
C1A: C45.1 IC40.3(C1A)  [project net C1A_1]
C1B: C49.2 IC40.28(C1B)  [project net C1B_1]
C2A: C44.1 IC40.40(C2A)  [project net C2A_1]
C2B: C48.2 IC40.31(C2B)  [project net C2B_1]
C3A: C43.1 IC40.6(C3A)  [project net C3A_1]
C3B: C47.2 IC40.25(C3B)  [project net C3B_1]
D1: IC41.7(D1) IC41.8(D1) IC41.E1(D1) L40.3 R45.2  [project net D1_1]
D2: C55.2 IC41.5(D2) IC41.6(D2) IC41.E2(D2) L40.1 R46.1  [project net D2_1]
KA: C44.2 C45.2 IC40.1(KA)  [project net KA_1]
N$30: IC40.23(RFB) R41.2  [project net N$30_1]
OUT: OUT.1(Signal) R47.2  [project net OUT_1]
OUT_C: C55.1 R47.1  [project net OUT_C_1]
PA: D40.A IC40.37(PA@37) IC40.38(PA@38) IC40.39(PA@39) IC41.1(S1) R43.1  [project net PA_1]
PB: D41.A IC40.32(PB@32) IC40.33(PB@33) IC40.34(PB@34) IC41.3(S2) R44.2  [project net PB_1]
VPP_LIM: C54.2 L40.2 L40.4 R40.1 R45.1 R46.2  [project net VPP_LIM_1]
VREF: C46.2 IC40.22(VREF) IC42.1(C) R42.1  [project net VREF_1]
NetC48_1: C48.1 C49.1 IC40.30(KB)
NetC50_1: C50.1 R43.2
NetC51_2: C51.2 R44.1

### Notes on the sheet
- NAME RANGE: 40 - 59
- Title
- Size:
- Date:
- A4
- Number:
- Time:
- Revision:
- Sheet
- of
- File:
- (in symbol MD2134K7) Vector; Beamforming; Switch; Matrix

### Library data of the parts
C40-C42 C46 C52 C53 = CMP-1035-00529-1: as C76 on sheet HA_Power; Rated Voltage: 100 V; Max Thickness: 1 mm; Technology: SMT; Tolerance: ±10%
C43-C45 C47-C49 = CMP-1035-00529-1: CAP 27nF 100V ±10% 0603 (1608 Metric) Thickness 1mm SMD; Case-Metric: 1608; Case-EIA: 0603; Rated Voltage: 100 V; Max Thickness: 1 mm; Technology: SMT; Tolerance: ±10%
C50 C51 = CMP-1036-00417-1: CAP 3.3nF 100V 0805 (2012 Metric) Thickness 0.75mm SMD; Case-EIA: 0805; Tolerance: ±10%; Case-Metric: 2012; Technology: SMT; Max Thickness: 0.75 mm; Rated Voltage: 100 V
C54 = CMP-1037-04411-1: as C1 on sheet HA_Diagram; Max Thickness: 1.9 mm; Rated Voltage: 100 V; Technology: SMT
C55 = CMP-1036-00417-1: CAP 0805 (2012 Metric) Thickness 0.75mm SMD; Case-EIA: 0805; Tolerance: ±10%; Case-Metric: 2012; Technology: SMT; Max Thickness: 0.75 mm; Value: 10nF; Rated Voltage: 250 V
D40 D41 = DIODE_SOD323
IC42 = LM4040DBZ: PRECISION MICROPOWER SHUNT VOLTAGE REFERENCE Adjustable Output   Source: http://focus.ti.com/lit/ds/slcs146e/slcs146e.pdf
L40 = LPD5235MR: Coilcraft
OUT = CONSMA003.062: SMA Female Edge Mount Connector; PCB_Layout: Pads complies with manufacturer's recommendation.; DatasheetVersion: rev1.0, Aug-2006; PackageVersion: rev1.0, Aug-2006; PackageReference: CON-SMA-EDGE062; PackageDescription: SMA Female Edge Mount Connector for 0.062" Thick Board, 7.9 mm Body Dia.; ComponentLink1Description: Manufacturer URL; ComponentLink1URL: http://www.linxtechnologies.com/; ComponentLink2Description: Datasheet; ComponentLink2URL: http://www.connectorcity.com/diagrams/SMA/CONSMA003.062.pdf
R40 = CMP-1018-00050-1: 1W 5% 2512 (6432 Metric)  SMD; Case-EIA: 2512; Case-Metric: 6432; Tolerance: 5 %; Power: 1 W; Technology: SMT
R41 = CMP-1012-00122-1: 49.9k 1% 0603 SMD; Value: 49.9k Ohm; Tolerance: 1 %
R42 = CMP-1012-00122-1: 200 1% 0603 SMD; Value: 200 Ohm; Tolerance: 1 %
R43 R44 = CMP-1018-00050-1: 1R 1W 5% 2512 (6432 Metric)  SMD; Case-EIA: 2512; Case-Metric: 6432; Tolerance: 5 %; Power: 1 W; Technology: SMT
R45 R46 = CMP-1018-00050-1: 100R 1W 5% 2512 (6432 Metric)  SMD; Case-EIA: 2512; Case-Metric: 6432; Tolerance: 5 %; Power: 1 W; Technology: SMT
R47 = CMP-1013-00429-1: 0.125W 1% 0805 (2012 Metric)  SMD; Case-EIA: 0805; Case-Metric: 2012; Technology: SMT; Power: 0.125 W; Tolerance: 1 %
IC40 = MD2134K7: MPN: MD2134K7

## Nets that join several sheets
3V3_INT: HA_Diagram (J_3V3.1), HA_Power (C72.2 L72.2 U72.6)
5V0_INT: HA_Diagram (J_5V0.1), HA_Power (8 pins)
+3V3: HA_Diagram (J_3V3.2 R2.1), HA_Out (5 pins)
+5V: HA_Diagram (J_5V0.2 R3.1), HA_Out (9 pins)
+12V: HA_Diagram (J_VPP.1), HA_Power (6 pins), HA_HiPower (6 pins)
GND: HA_Diagram (9 pins), HA_Power (11 pins), HA_HiPower (12 pins), HA_Out (29 pins)
HiVoltage: HA_Diagram (J_VPP.3), HA_HiPower (C23.1 D20.C R27.2)
VPP: HA_Diagram (5 pins), HA_Out (R40.2)
BF_CS: HA_Diagram (J6.5), HA_Out (IC40.19)
BF_EN: HA_Diagram (J3.1 R1.2), HA_Out (IC40.21)
BF_LD: HA_Diagram (J3.3), HA_Out (IC40.20)
BF_M0: HA_Diagram (J3.11), HA_Out (IC40.15)
BF_M1: HA_Diagram (J3.9), HA_Out (IC40.14)
BF_M2: HA_Diagram (J3.7), HA_Out (IC40.13)
BF_M3: HA_Diagram (J3.5), HA_Out (IC40.12)
BF_MISO: HA_Diagram (J6.1), HA_Out (IC40.18)
BF_MOSI: HA_Diagram (J6.4), HA_Out (IC40.11)
BF_SCK: HA_Diagram (J6.3), HA_Out (IC40.10)